# EAGLE design LB_BIT_1IN_3OUT-MEDIUM-v03(1_1x) (EAGLE 6.5.0)
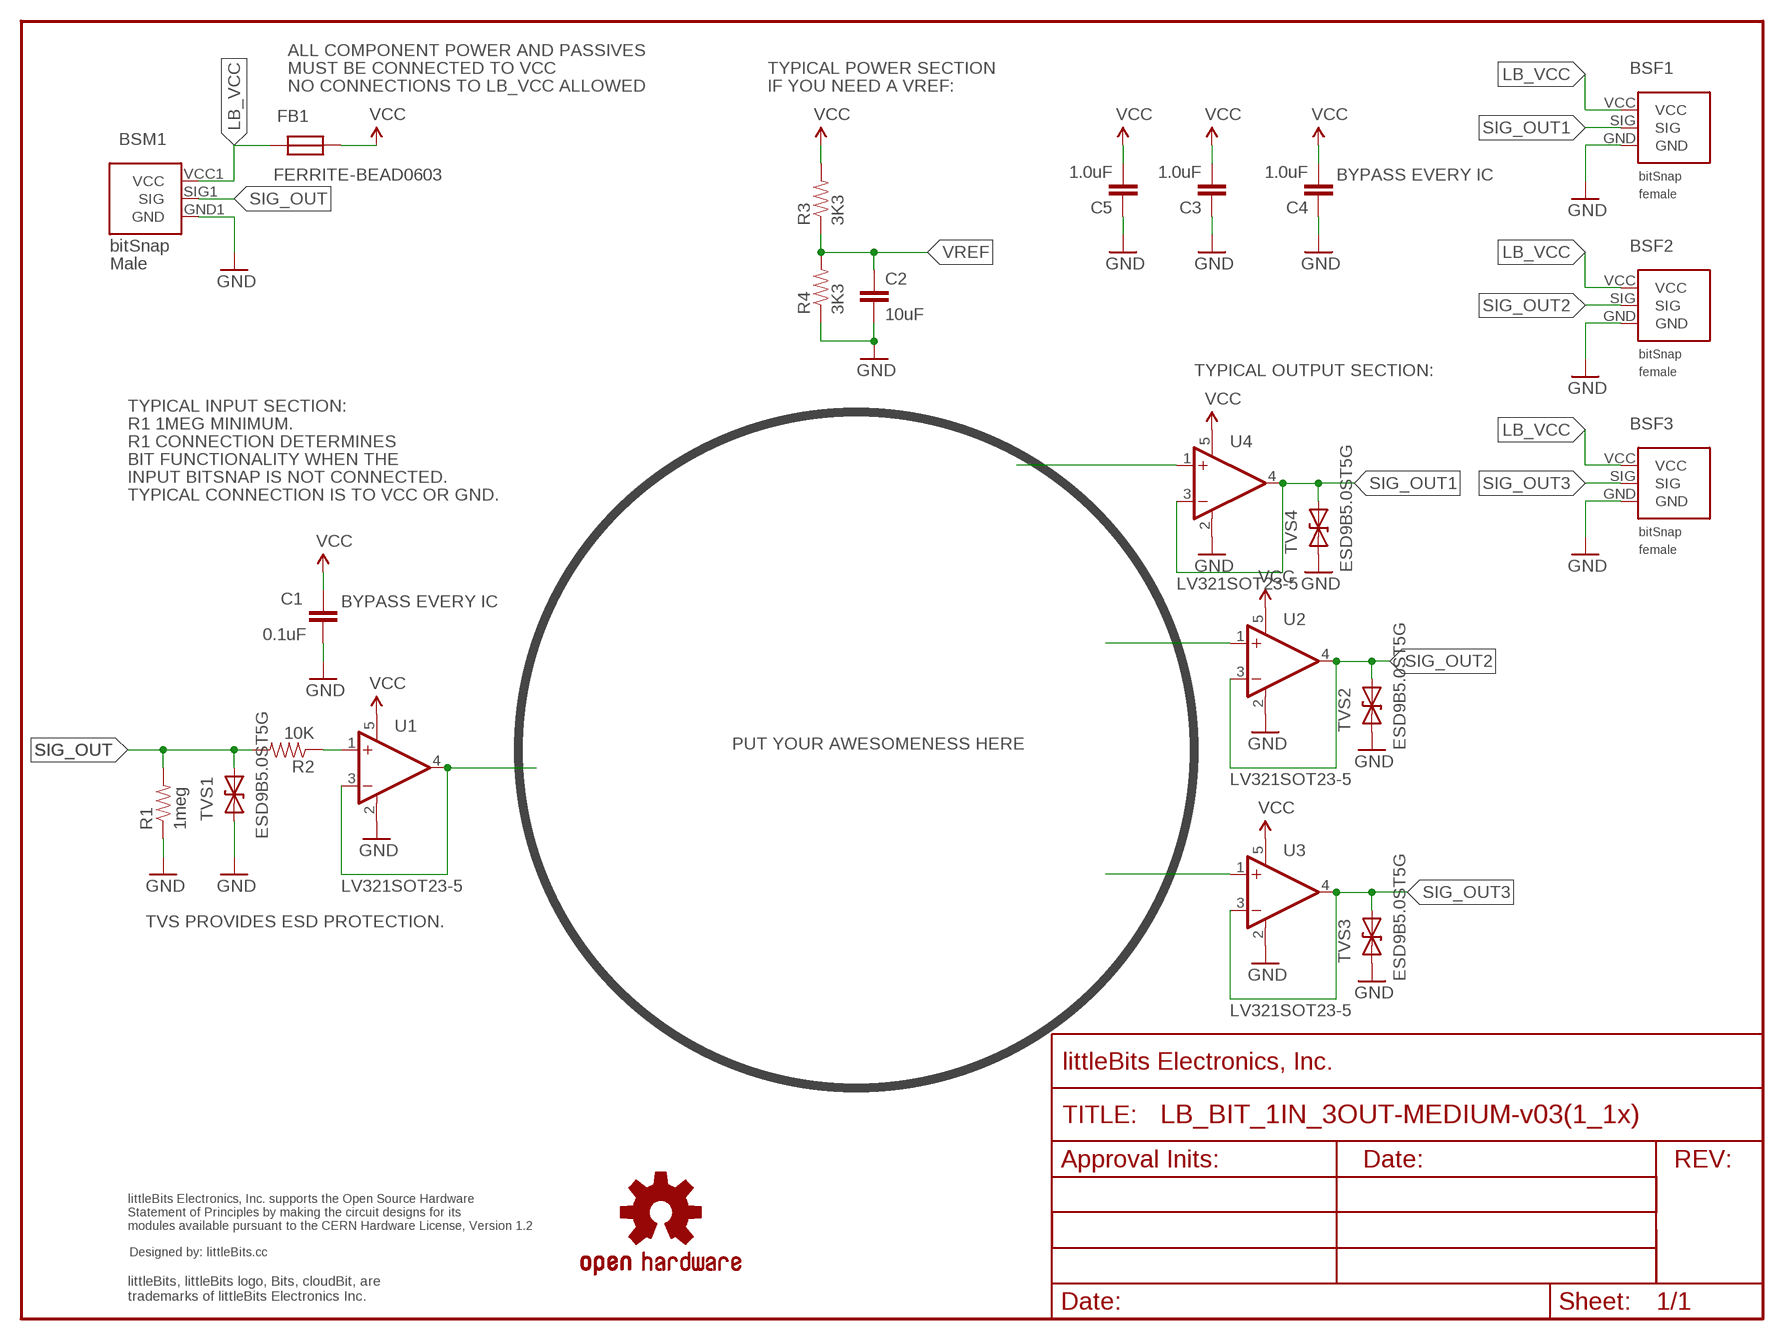
[diagram p0: schematic, sheet 1]

## Parts
BSF1  BITSNAP_V03_FEMALE  [BITSNAP_V03_FEMALE]
BSF2  BITSNAP_V03_FEMALE  [BITSNAP_V03_FEMALE]
BSF3  BITSNAP_V03_FEMALE  [BITSNAP_V03_FEMALE]
BSM1  BITSNAP_V03_MALE  [BITSNAP_V03_MALE]
C1  0.1uF  CAPCAP-0603  [CAP-0603]
C2  10uF  CAPCAP-0603  [CAP-0603]
C3  1.0uF  CAPCAP-0603  [CAP-0603]
C4  1.0uF  CAPCAP-0603  [CAP-0603]
C5  1.0uF  CAPCAP-0603  [CAP-0603]
FB1  FERRITE-BEAD0603  [R0603]
FRAME1  FRAME-LETTER  [FABDWG01-OHW]
R1  1meg  RESISTOR0603  [RES-0603]
R2  10K  RESISTOR0603  [RES-0603]
R3  3K3  RESISTOR0603  [RES-0603]
R4  3K3  RESISTOR0603  [RES-0603]
TVS1  ESD9B5.0ST5G  DIODE-TVSSOD-923  [SOD-923]
TVS2  ESD9B5.0ST5G  DIODE-TVSSOD-923  [SOD-923]
TVS3  ESD9B5.0ST5G  DIODE-TVSSOD-923  [SOD-923]
TVS4  ESD9B5.0ST5G  DIODE-TVSSOD-923  [SOD-923]
U1  LV321SOT23-5  [SOT23-5]
U2  LV321SOT23-5  [SOT23-5]
U3  LV321SOT23-5  [SOT23-5]
U4  LV321SOT23-5  [SOT23-5]
U$2  OSHWCREDIT  [OSHWCREDIT]
U$3  OSHW-LOGOL  [OSHW-LOGO-L]

## Nets
GND: BSF1.GND BSF2.GND BSF3.GND BSM1.GND1(GND) C1.2 C2.2 C3.1 C4.1 C5.1 R1.1 R4.1 TVS1.1(A) TVS2.1(A) TVS3.1(A) TVS4.1(A) U1.2(V-) U2.2(V-) U3.2(V-) U4.2(V-)
LB_VCC: BSF1.VCC BSF2.VCC BSF3.VCC BSM1.VCC1(VCC) FB1.2
N$1: U2.1(+IN)
N$2: U3.1(+IN)
N$3: U1.3(-IN) U1.4(OUT)
N$4: R2.1 U1.1(+IN)
N$12: U4.1(+IN)
SIG_OUT: BSM1.SIG1(SIG) R1.2 R2.2 TVS1.2(C)
SIG_OUT1: BSF1.SIG TVS4.2(C) U4.3(-IN) U4.4(OUT)
SIG_OUT2: BSF2.SIG TVS2.2(C) U2.3(-IN) U2.4(OUT)
SIG_OUT3: BSF3.SIG TVS3.2(C) U3.3(-IN) U3.4(OUT)
VCC: C1.1 C3.2 C4.2 C5.2 FB1.1 R3.2 U1.5(V+) U2.5(V+) U3.5(V+) U4.5(V+)
VREF: C2.1 R3.1 R4.2

## Notes on the sheet
- ALL COMPONENT POWER AND PASSIVES
- MUST BE CONNECTED TO VCC | TYPICAL POWER SECTION
- NO CONNECTIONS TO LB_VCC ALLOWED | IF YOU NEED A VREF:
- BYPASS EVERY IC
- TYPICAL OUTPUT SECTION:
- TYPICAL INPUT SECTION:
- R1 1MEG MINIMUM.
- R1 CONNECTION DETERMINES
- BIT FUNCTIONALITY WHEN THE
- INPUT BITSNAP IS NOT CONNECTED.
- TYPICAL CONNECTION IS TO VCC OR GND.
- BYPASS EVERY IC
- PUT YOUR AWESOMENESS HERE
- TVS PROVIDES ESD PROTECTION.

## Library data of the parts
BSF1-BSF3 = bitSnap:BITSNAP_V03_FEMALE
BSM1 = bitSnap:BITSNAP_V03_MALE
C1-C5 = LITTLEBITS:CAP
FB1 = LITTLEBITS:FERRITE-BEAD
FRAME1 = LITTLEBITS:FRAME-LETTER
R1-R4 = LITTLEBITS:RESISTOR
TVS1-TVS4 = LITTLEBITS:DIODE-TVS: Bidirectional Transient Voltage Suppression Diode: Device conducts in avalanche mode after reaching a part dependent voltage threshold. Used for limiting voltage spikes on ESD sensitive inputs and outputs.; IEC_ESD_PROT0: +/-18kV; LB_PN: ?; MPN: ESD9B5.0ST5G; V_CLAMP: ?; V_OPERATION: 5V
U1-U4 = LITTLEBITS:LV321
U$2 = LITTLEBITS:OSHWCREDIT
U$3 = LITTLEBITS131206:OSHW-LOGO: Open Source Hardware Logo This logo indicates the piece of hardware it is found on incorporates a OSHW license and/or adheres to the definition of open source hardware found here: http://freedomdefined.org/OSHW

## Board
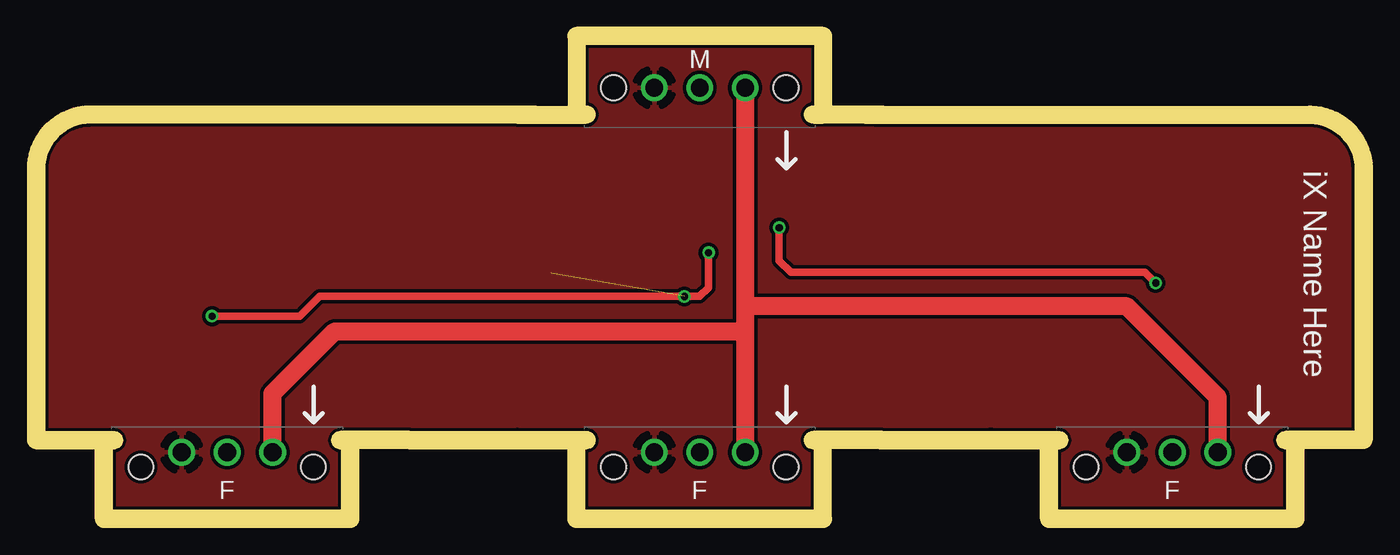
[diagram p1: board, top side]
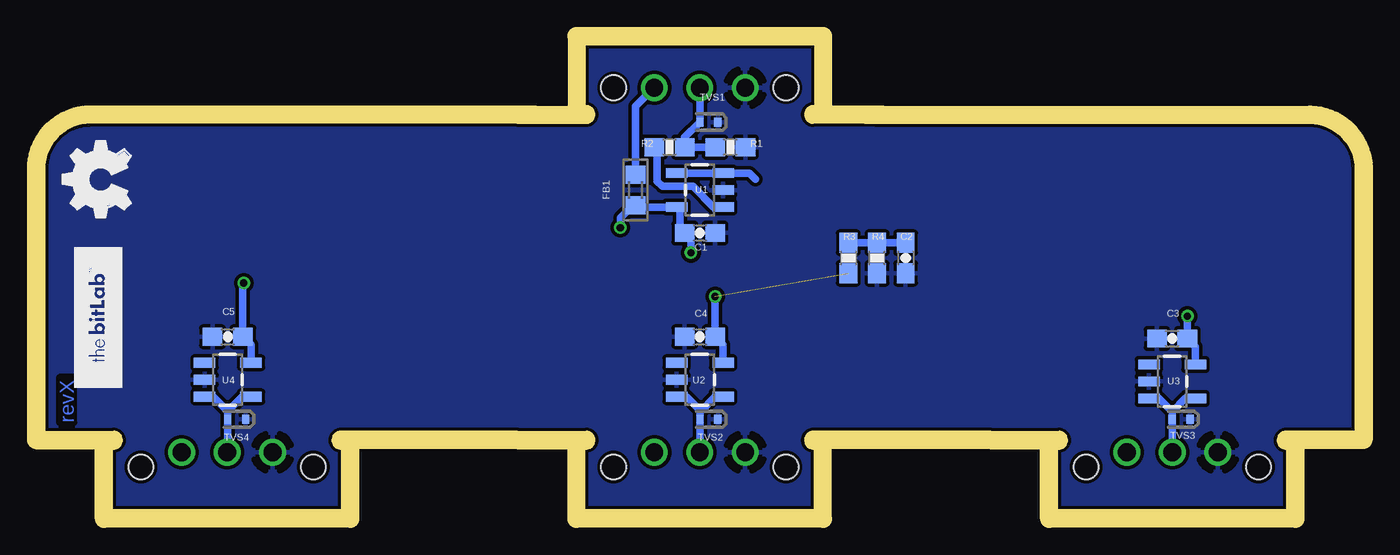
[diagram p2: board, bottom side, seen from below]

Size 73.24 x 26 mm. Coordinates in mm from the lower left corner, seen from the top.
Outline: 0,4.4 0,19 arc-90 2.5,21.6 26.81,21.6
Outline: 20.34,4.4 30.3,4.4
Outline: 46.8,4.4 52.98,4.4
Outline: 73.24,4.4 73.24,19 arc90 70.74,21.6 46.43,21.6
Copper layers (1*16): Top 0.035mm / dielectric 1.5mm / Bottom 0.035mm
Design rules "littleBitsDRC": minimum track width 0.2mm, minimum drill 0.4mm, track to track 0.2mm, track to pad 0.2mm, pad to pad 0.2mm, via to via 0.2mm, smd to smd 0mil, copper to edge 0.2mm, drill to drill 0.2mm, minimum pad ring 0.2mm, minimum via ring 0.15mm, stop-mask expansion 0.1mm, vias tented up to drill 0mil, thermal gap 0.2mm
Milling: 10 lines

### Footprints (pad centres in the part's own frame; a part is rotated, then mirrored left to right if it is on the bottom)
BITSNAP_V03_FEMALE = drill 1: GND 4.065,3.44; SIG 6.605,3.44; VCC 9.145,3.44 | hole 1.4: 1.785,2.61; 11.425,2.61
BITSNAP_V03_MALE = drill 1: GND1 9.145,2.61; SIG1 6.605,2.61; VCC1 4.065,2.61 | hole 1.4: 1.785,2.61; 11.425,2.61
CAP-0603 = smd 1.1 x 1: 1 -0.85,0; 2 0.85,0
R0603 = smd 1 x 1.1: 1 -0.85,0; 2 0.85,0
RES-0603 = smd 1.1 x 1: 1 -0.85,0; 2 0.85,0
SOD-923 = smd 0.4 x 0.5: 1 -0.5,0; 2 0.5,0
SOT23-5 = smd 0.55 x 1.2: 1 -0.95,-1.3; 2 0,-1.3; 3 0.95,-1.3; 4 0.95,1.3; 5 -0.95,1.3

### Placement (x,y rotation side)
BSF1  56.44,-0.21 0 top
BSF2  30.02,-0.21 0 top
BSF3  3.59,-0.21 0 top
BSM1  43.23,26.21 180 top
C1  36.61,15.48 0 bottom
C2  25.11,14.08 270 bottom
C3  10.21,9.58 0 bottom
C4  36.61,9.68 0 bottom
C5  63.01,9.68 0 bottom
FB1  40.21,17.88 90 bottom
FRAME1  23.41,-0.21 0 top
R1  34.91,20.28 180 bottom
R2  38.31,20.28 0 bottom
R3  28.31,14.08 270 bottom
R4  26.71,14.08 90 bottom
TVS1  36.11,21.68 180 bottom
TVS2  36.11,5.08 180 bottom
TVS3  9.71,5.08 180 bottom
TVS4  62.51,5.08 180 bottom
U1  36.61,17.88 90 bottom
U2  36.61,7.28 270 bottom
U3  10.21,7.18 270 bottom
U4  63.01,7.28 270 bottom
U$1  [BITLAB-LOGO]  68.91,14.68 270 top
U$2  -70.62,-61.02 0 top  (outside the outline)
U$3  -11.46,-66.77 0 top  (outside the outline)
U$21  [OSHW_FILLX150_NOTEXT]  68.43,15.52 0 top

### Tracks (layer width: path | path; a pad name or v marks a point on that pad's centre or on a via)
GND
  pour Bottom: 73.31,25.98 73.31,-0.12 0.01,-0.12 0.01,26.08
  pour Top: 0.01,26.08 73.31,25.98 73.31,-0.12 0.01,-0.12
LB_VCC
  Top 1: BSM1.VCC1 39.16,11.38 | 39.16,11.38 39.16,9.98 | 39.16,9.98 BSF2.VCC | BSF1.VCC 65.58,6.31 60.51,11.38 39.16,11.38 | BSF3.VCC 12.74,6.51 16.21,9.98 39.16,9.98
  Bottom 0.406: FB1.2 40.21,22.55 BSM1.VCC1
N$3
  Bottom 0.406: U1.4 U1.3 33.85,18.83 33.51,18.49
N$4
  Bottom 0.406: R2.1 39.01,20.28 39.01,18.38 38.71,18.08 37.01,18.08 35.86,16.93 U1.1
SIG_OUT
  Bottom 0.406: R1.2 R2.2 37.46,20.83 TVS1.2 BSM1.SIG1
SIG_OUT1
  Bottom 0.406: U4.4 62.21,6.33 63.01,5.53 | 63.01,5.53 TVS4.2 63.01,3.26 BSF1.SIG | 63.01,5.53 63.81,6.33 U4.3
SIG_OUT2
  Bottom 0.406: U2.4 35.76,6.33 36.56,5.53 | 36.56,5.53 36.61,5.48 TVS2.2 BSF2.SIG | 36.56,5.53 37.36,6.33 U2.3
SIG_OUT3
  Bottom 0.406: U3.4 9.46,6.23 10.21,5.48 | 10.21,5.48 TVS3.2 BSF3.SIG | 10.21,5.48 10.96,6.23 U3.3
VCC  (via drill 0.4)  (1 unrouted)
  Top 0.406: v37.11,14.38 37.11,12.43 36.61,11.93 v35.76,11.93 15.36,11.93 14.26,10.83 v9.36,10.83 | v41.06,15.78 41.06,13.93 41.71,13.28 61.51,13.28 v62.11,12.68
  Bottom 0.406: v41.06,15.78 41.06,16.33 40.36,17.03 FB1.1 40.21,16.93 U1.5 37.71,16.93 37.71,15.73 C1.1 37.11,15.13 v37.11,14.38 | v35.76,11.93 C4.2 35.31,9.23 U2.5 | U3.5 8.91,9.13 C3.2 v9.36,10.83 | U4.5 61.71,9.23 C5.2 62.16,12.63 v62.11,12.68
VREF
  Bottom 0.406: R3.1 R4.2 C2.1

### Text on the board
Bottom: revX
tPlace: iX Name Here
Measures: C.L.